# EAGLE design OpenC4D_Shield-version2 (EAGLE 9.6.2)
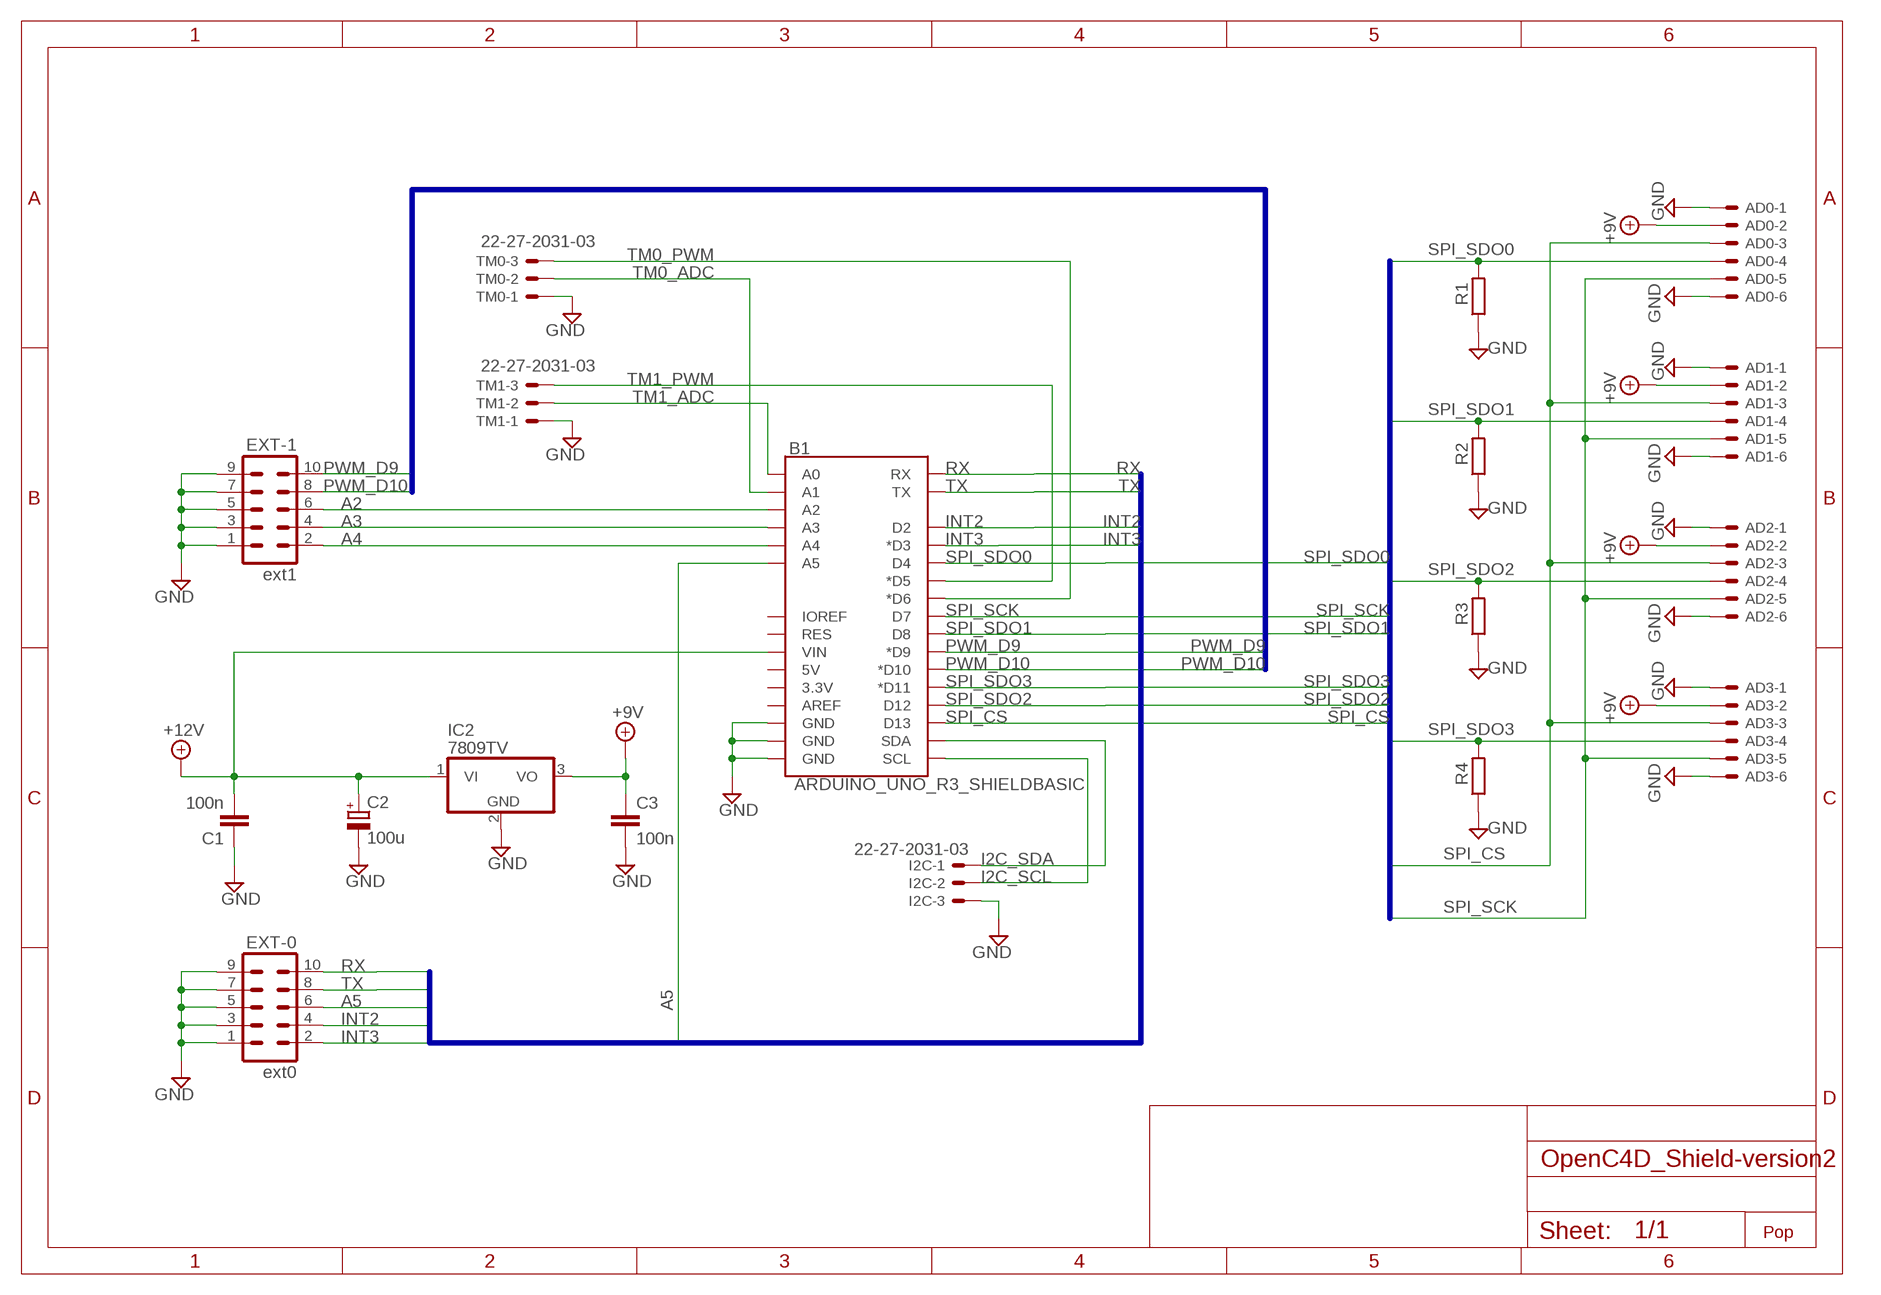
[diagram p0: schematic, sheet 1]

## Parts
AD0  22-27-2061-06  [6410-06]
AD1  22-27-2061-06  [6410-06]
AD2  22-27-2061-06  [6410-06]
AD3  22-27-2061-06  [6410-06]
B1  ARDUINO_UNO_R3_SHIELDBASIC  [UNO_R3_SHIELD]
C1  100n  C-EU050-025X075  [C050-025X075]
C2  100u  CPOL-EUE3.5-8  [E3,5-8]
C3  100n  C-EU050-025X075  [C050-025X075]
EXT-0  ext0  ML10  [ML10]
EXT-1  ext1  ML10  [ML10]
I2C  22-27-2031-03  [6410-03]
IC2  7809TV  7812TV  [TO220V]
R1  R0204/7  [0204/7]
R2  R0204/7  [0204/7]
R3  R0204/7  [0204/7]
R4  R0204/7  [0204/7]
TM0  22-27-2031-03  [6410-03]
TM1  22-27-2031-03  [6410-03]

## Nets
+9V: AD0.2 AD1.2 AD2.2 AD3.2 C3.1 IC2.3(VO)
+12V: B1.VIN C1.2 C2.+ IC2.1(VI)
A2: B1.A2 EXT-1.6
A3: B1.A3 EXT-1.4
A4: B1.A4 EXT-1.2
A5: B1.A5 EXT-0.6
GND: AD0.1 AD0.6 AD1.1 AD1.6 AD2.1 AD2.6 AD3.1 AD3.6 B1.GND@0(GND) B1.GND@1(GND) B1.GND@2(GND) C1.1 C2.- C3.2 EXT-0.1 EXT-0.3 EXT-0.5 EXT-0.7 EXT-0.9 EXT-1.1 EXT-1.3 EXT-1.5 EXT-1.7 EXT-1.9 I2C.3 IC2.2(GND) R1.1 R2.1 R3.1 R4.1 TM0.1 TM1.1
I2C_SCL: B1.SCL I2C.2
I2C_SDA: B1.SDA I2C.1
INT2: B1.D2 EXT-0.4
INT3: B1.D3(*D3) EXT-0.2
PWM_D9: B1.D9(*D9) EXT-1.10
PWM_D10: B1.D10(*D10) EXT-1.8
RX: B1.RX EXT-0.10
SPI_CS: AD0.3 AD1.3 AD2.3 AD3.3 B1.D13
SPI_SCK: AD0.5 AD1.5 AD2.5 AD3.5 B1.D7
SPI_SDO0: AD0.4 B1.D4 R1.2
SPI_SDO1: AD1.4 B1.D8 R2.2
SPI_SDO2: AD2.4 B1.D12 R3.2
SPI_SDO3: AD3.4 B1.D11(*D11) R4.2
TM0_ADC: B1.A1 TM0.2
TM0_PWM: B1.D6(*D6) TM0.3
TM1_ADC: B1.A0 TM1.2
TM1_PWM: B1.D5(*D5) TM1.3
TX: B1.TX EXT-0.8
Unconnected: B1.3.3V B1.5V B1.AREF B1.IOREF B1.RES

## Buses
A5,INT2,INT3,RX,TX
PWM_D9,PWM_D10
SPI_CS,SPI_SCK,SPI_SDO0,SPI_SDO1,SPI_SDO2,SPI_SDO3

## Notes on the sheet
- Pop

## Library data of the parts
AD0 AD1-AD3 = con-molex:22-?-06: CONNECTOR wire to board 2.54 mm (.1 inch) pitch header
B1 = SparkFun-Boards:ARDUINO_UNO_R3_SHIELD: Arduino R3 Shield Footprint Shield form compatible with the Arduino Uno R3. SparkFun Products: MG2639 Cellular Shield <https://www.sparkfun.com/products/13120> MIDI Shield <https://www.sparkfun.com/products/12898> R3 Stackable Headers Kit <https://www.sparkfun.com/products/11417>; SPICEPREFIX: X
C1 C3 = rcl:C-EU: CAPACITOR, European symbol
C2 = rcl:CPOL-EU: POLARIZED CAPACITOR, European symbol
EXT-0 EXT-1 = con-ml:ML10: HARTING
I2C TM0 TM1 = con-molex:22-?-03: CONNECTOR wire to board 2.54 mm (.1 inch) pitch header
IC2 = linear:78*: Positive VOLTAGE REGULATOR Source: http://cache.national.com/ds/LM/LM78L05.pdf http://www.fairchildsemi.com/ds/LM/LM7805.pdf
R1-R4 = eagle-ltspice:R: RESISTOR, European symbol; SPICEMODEL: NONE; SPICEPREFIX: R

## Board
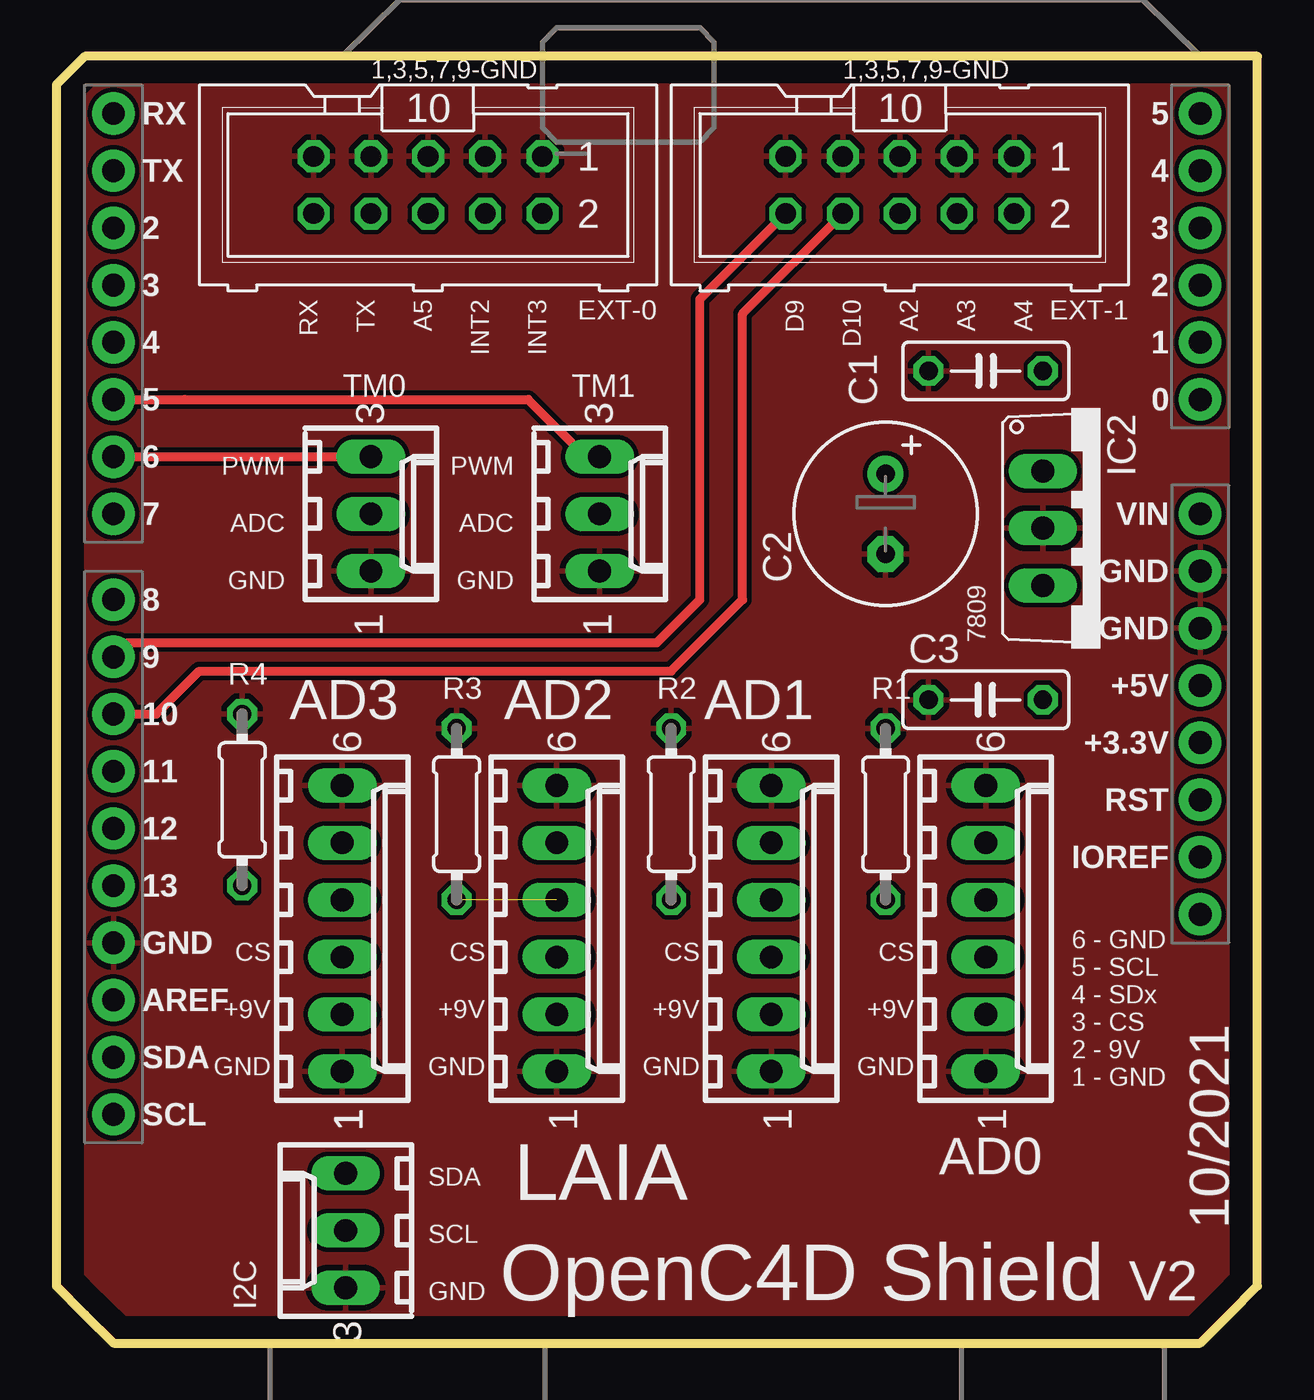
[diagram p1: board, top side]
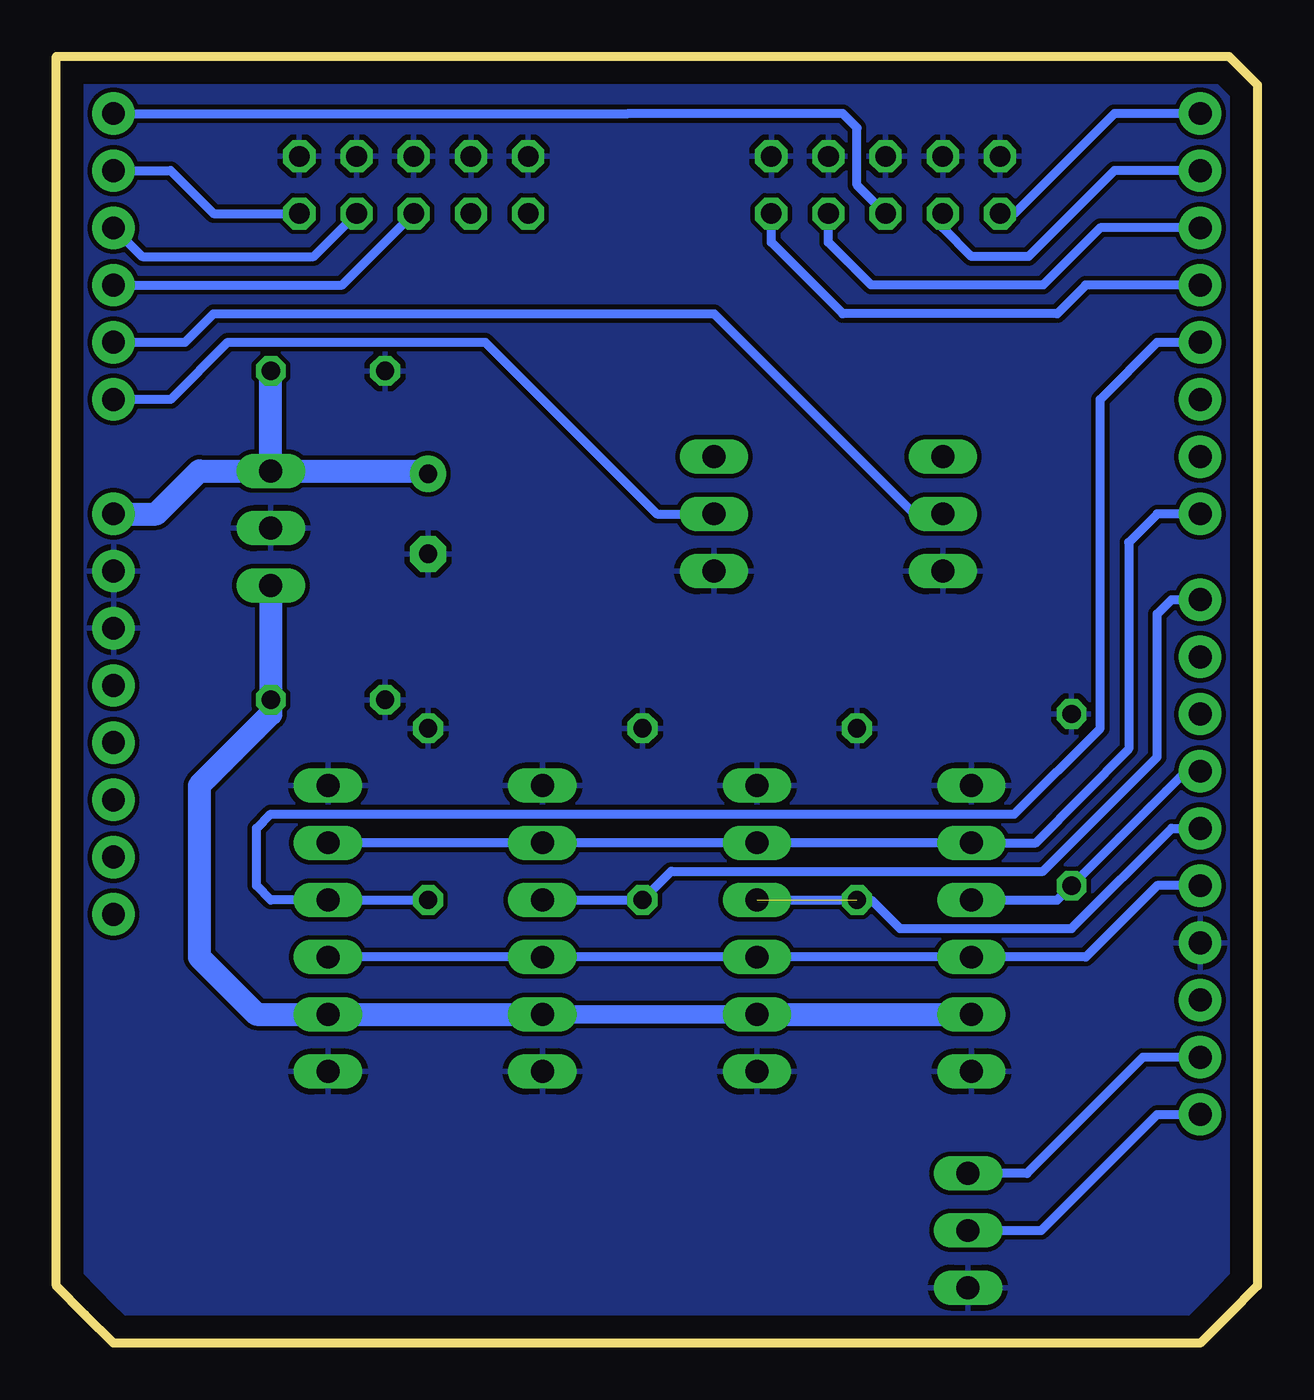
[diagram p2: board, bottom side, seen from below]

Size 53.34 x 57.15 mm. Coordinates in mm from the lower left corner, seen from the top.
Outline: 0,55.88 0,2.54 1.27,1.27 2.54,0 50.8,0 52.07,1.27 53.34,2.54 53.34,57.15 1.27,57.15 0,55.88
Copper layers (1*16): Top 0.035mm / dielectric 1.5mm / Bottom 0.035mm
Design rules "default *": minimum track width 10mil, minimum drill 24mil, track to track 8mil, track to pad 8mil, pad to pad 8mil, via to via 8mil, smd to smd 8mil, copper to edge 40mil, drill to drill 8mil, minimum pad ring 10mil, minimum via ring 8mil, stop-mask expansion 4mil, vias tented up to drill 0mil, thermal gap 10mil

### Footprints (pad centres in the part's own frame; a part is rotated, then mirrored left to right if it is on the bottom)
6410-06 = drill 1.016 long: 1 6.35,0; 2 3.81,0; 3 1.27,0; 4 -1.27,0; 5 -3.81,0; 6 -6.35,0
UNO_R3_SHIELD = drill 1.016 pad 1.88: 3.3V 24.13,-2.54; 5V 24.13,0; A0 24.13,12.7; A1 24.13,15.24; A2 24.13,17.78; A3 24.13,20.32; A4 24.13,22.86; A5 24.13,25.4; AREF -24.13,-13.97; D2 -24.13,20.32; D3 -24.13,17.78; D4 -24.13,15.24; D5 -24.13,12.7; D6 -24.13,10.16; D7 -24.13,7.62; D8 -24.13,3.81; D9 -24.13,1.27; D10 -24.13,-1.27; D11 -24.13,-3.81; D12 -24.13,-6.35; D13 -24.13,-8.89; GND@0 24.13,2.54; GND@1 24.13,5.08; GND@2 -24.13,-11.43; IOREF 24.13,-7.62; NC 24.13,-10.16; RES 24.13,-5.08; RX -24.13,25.4; SCL -24.13,-19.05; SDA -24.13,-16.51; TX -24.13,22.86; VIN 24.13,7.62
C050-025X075 = drill 0.813 octagon: 1 -2.54,0; 2 2.54,0
E3,5-8 = drill 0.813 pad 1.6: + -1.778,0 | drill 0.813 pad 1.6 octagon: - 1.778,0
ML10 = drill 0.914 octagon: 1 -5.08,-1.27; 2 -5.08,1.27; 3 -2.54,-1.27; 4 -2.54,1.27; 5 0,-1.27; 6 0,1.27; 7 2.54,-1.27; 8 2.54,1.27; 9 5.08,-1.27; 10 5.08,1.27
6410-03 = drill 1.016 long: 1 2.54,0; 2 0,0; 3 -2.54,0
TO220V = drill 1.016 long: 1 -2.54,-2.54; 2 0,-2.54; 3 2.54,-2.54
0204/7 = drill 0.813 octagon: 1 -3.81,0; 2 3.81,0

### Placement (x,y rotation side)
AD0  41.27,18.41 270 top
AD1  31.75,18.41 270 top
AD2  22.23,18.41 270 top
AD3  12.7,18.41 270 top
B1  26.67,29.21 0 top
C1  41.27,43.18 0 top
C2  36.83,36.83 270 top
C3  41.27,28.57 180 top
EXT-0  16.51,51.44 180 top
EXT-1  37.47,51.44 180 top
I2C  12.85,5 90 top
IC2  46.35,36.2 270 top
R1  36.83,23.5 270 top
R2  27.3,23.5 270 top
R3  17.78,23.5 270 top
R4  8.26,24.13 270 top
TM0  13.97,36.83 270 top
TM1  24.13,36.83 270 top

### Tracks (layer width: path | path; a pad name or v marks a point on that pad's centre or on a via)
+9V
  Bottom 0.254: AD2.2 AD1.2 AD0.2
  Bottom 0.813: AD2.2 AD1.2
  Bottom 1.016: IC2.3 43.81,30.48 C3.1 43.81,27.94 46.99,24.77 46.99,17.14 44.45,14.61 AD1.2 | AD2.2 AD3.2
+12V
  Bottom 1.016: B1.VIN 48.9,36.83 46.99,38.73 IC2.1 | IC2.1 C1.2 | IC2.1 36.96,38.73 C2.+
A2
  Bottom 0.406: B1.A2 40.64,46.99 EXT-1.6
A3
  Bottom 0.406: B1.A3 49.53,48.26 41.91,48.26 EXT-1.4
A4
  Bottom 0.406: B1.A4 48.26,52.07 46.35,50.16 EXT-1.2
A5
  Bottom 0.406: B1.A5 27.94,54.61 18.41,54.61 17.78,53.98 17.78,51.44 EXT-0.6
GND
  pour Top: 1.27,57.15 0,55.88 0,2.54 2.54,0 50.8,0 53.34,2.54 53.34,57.15
  pour Bottom: 1.27,57.15 0,55.88 0,2.54 2.54,0 50.8,0 53.34,2.54 53.34,57.15
I2C_SCL
  Bottom 0.406: B1.SCL 4.45,10.16 9.6,5 I2C.2
I2C_SDA
  Bottom 0.406: B1.SDA 5.08,12.7 10.24,7.54 I2C.1
INT2
  Bottom 0.406: B1.D2 6.99,49.53 9.53,46.99 17.14,46.99 19.05,48.9 EXT-0.4
INT3
  Bottom 0.406: B1.D3 7.62,46.99 8.89,45.72 18.41,45.72 21.59,48.9 EXT-0.2
PWM_D9
  Top 0.406: B1.D9 3.17,31.11 26.67,31.11 28.57,33.02 28.57,46.35 EXT-1.10
PWM_D10
  Top 0.406: EXT-1.8 30.48,45.72 30.48,33.02 27.3,29.84 6.35,29.84 4.45,27.94 B1.D10
RX
  Bottom 0.406: B1.RX 6.35,54.61 10.79,50.16 EXT-0.10
SPI_CS
  Bottom 0.406: AD0.3 AD1.3 AD2.3 AD3.3 7.62,17.14 4.45,20.32 B1.D13
SPI_SCK
  Bottom 0.406: AD0.5 AD1.5 AD2.5 AD3.5 9.83,22.23 5.71,26.4 5.71,35.56 4.45,36.83 B1.D7
SPI_SDO0
  Bottom 0.406: B1.D4 4.45,44.45 6.99,41.91 6.99,27.3 10.79,23.5 43.81,23.5 44.45,22.86 44.45,20.32 43.81,19.68 AD0.4 R1.2
SPI_SDO1
  Bottom 0.406: AD1.4 R2.2 26.04,20.95 9.53,20.95 4.45,26.04 4.45,32.38 3.81,33.02 B1.D8
SPI_SDO2  (1 unrouted)
  Bottom 0.406: B1.D12 3.81,22.86 8.26,18.41 15.88,18.41 17.14,19.68 AD2.4
SPI_SDO3
  Bottom 0.406: AD3.4 8.89,19.68 | 8.89,19.68 3.17,25.4 B1.D11 | R4.2 8.89,19.68
TM0_ADC
  Bottom 0.406: B1.A1 47.62,44.45 46.35,45.72 24.13,45.72 20.32,41.91 15.24,36.83 TM0.2
TM0_PWM
  Top 0.406: TM0.3 10.79,39.37 B1.D6
TM1_ADC
  Bottom 0.254: B1.A0 48.26,41.91
  Bottom 0.406: TM1.2 26.67,36.83 34.29,44.45 45.72,44.45 48.26,41.91 B1.A0
TM1_PWM
  Top 0.406: B1.D5 5.71,41.91 20.95,41.91 23.5,39.37 TM1.3
TX
  Bottom 0.406: B1.TX 6.35,52.07 10.16,48.26 12.7,48.26 13.97,49.53 EXT-0.8

### Text on the board
tPlace: 10/2021
tNames: 1,3,5,7,9-GND | 1,3,5,7,9-GND | RX | TX | A5 | INT2 | INT3 | D9 | D10 | A2 | A3 | A4 | PWM | PWM | ADC | ADC | GND | GND | 7809 | CS | CS | CS | CS | +9V | +9V | +9V | +9V | GND | GND | GND | GND | 6 - GND / 5 - SCL / 4 - SDx / 3 - CS / 2 - 9V / 1 - GND | SDA | LAIA | SCL | GND | OpenC4D Shield | V2